# Altium project Rev4.1.PrjPcb
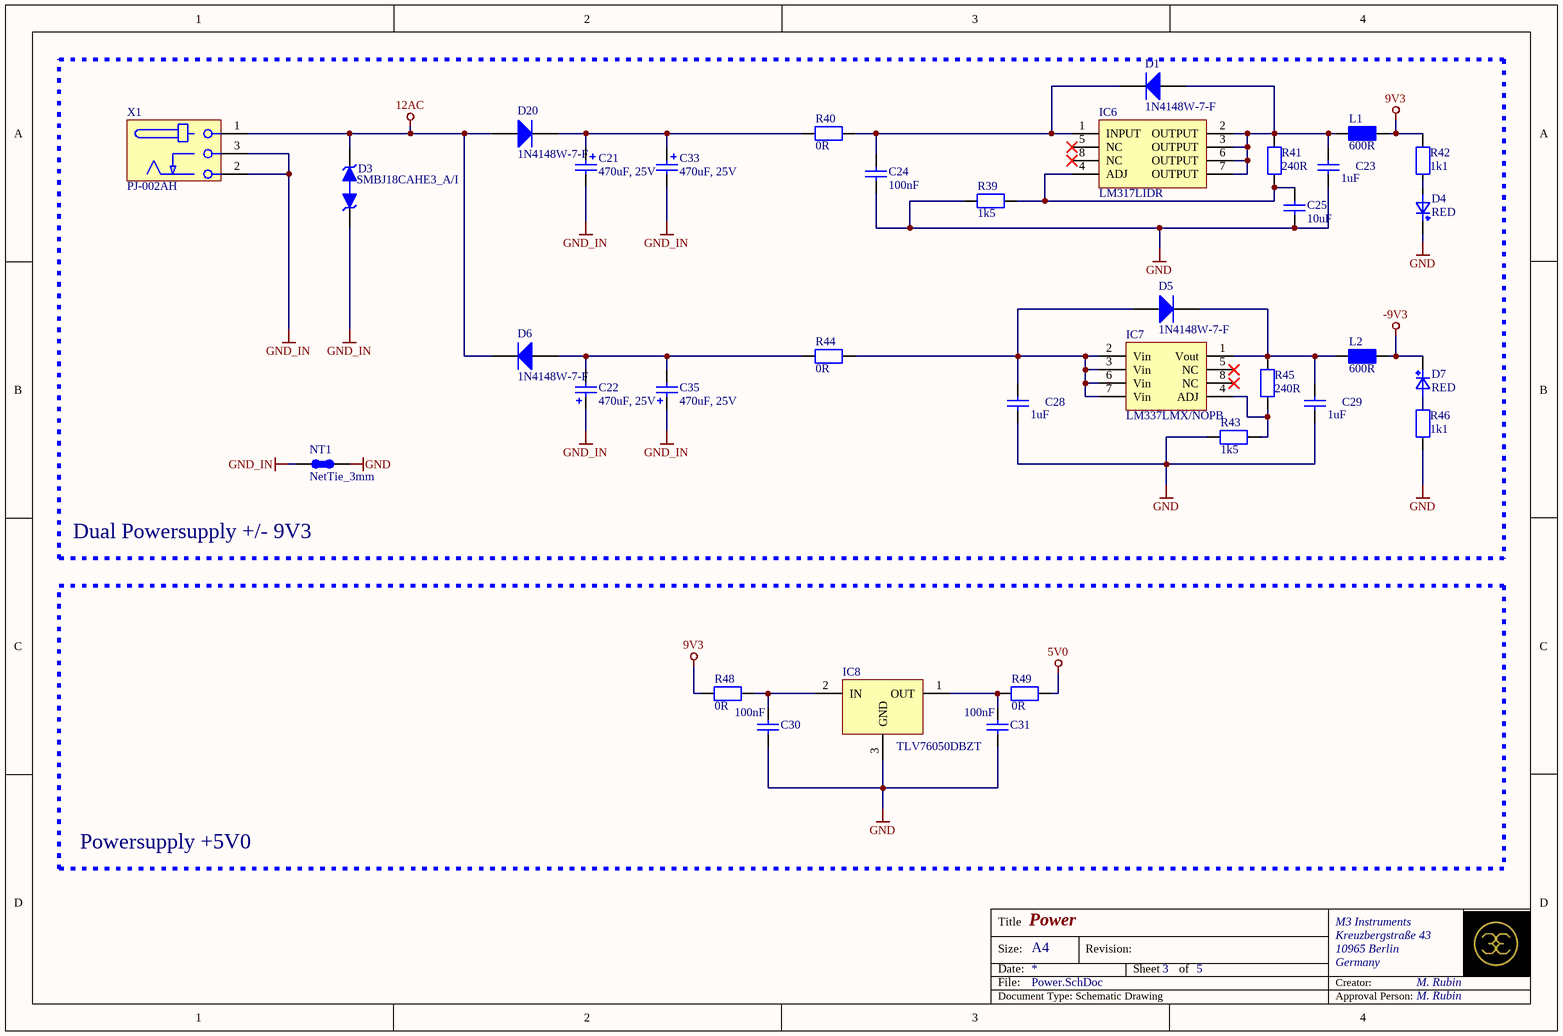
[diagram p0: Power.SchDoc]
Address2: Kreuzbergstraße 43; Address3: 10965 Berlin; Address4: Germany; ApprovalSchematic: M. Rubin; CompanyName: M3 Instruments; CreatorSchematic: M. Rubin
5 sheets, 198 parts. Net scope: flat (ports and power ports of the same name join across sheets).
Board file: mib-pcb0009.PcbDoc
Sheets:
  Power.SchDoc
  LED-Meter.SchDoc
  Filter_R.SchDoc
  Filter_L.SchDoc
  Connector.SchDoc

## Sheet Power.SchDoc: Power
size A4; SheetNumber: 3; SheetTotal: 5

### Parts
C21  470uF, 25V  [WCAP-ATG8_D8H11.5]
C22  470uF, 25V  [WCAP-ATG8_D8H11.5]
C23  1uF  [CAPC2012X145N]
C24  100nF  [CAPC1608X95N]
C25  10uF  [CAPC2012X145N]
C28  1uF  [CAPC2012X145N]
C29  1uF  [CAPC2012X145N]
C30  100nF  [CAPC1608X95N]
C31  100nF  [CAPC1608X95N]
C33  470uF, 25V  [WCAP-ATG8_D8H11.5]
C35  470uF, 25V  [WCAP-ATG8_D8H11.5]
D1  1N4148W-7-F  [SOD-123]
D3  SMBJ18CAHE3_A/I  [DIOM4336X24N]
D4  RED  [WL-SMCW_0805]
D5  1N4148W-7-F  [SOD-123]
D6  1N4148W-7-F  [SOD-123]
D7  RED  [WL-SMCW_0805]
D20  1N4148W-7-F  [SOD-123]
IC6  LM317LIDR  [SOIC127P600X175-8N]
IC7  LM337LMX/NOPB  [SOIC127P600X175-8N]
IC8  TLV76050DBZT  [SOT95P280X135-3N_123]
L1  600R  [INDC2012X85N]
L2  600R  [INDC2012X85N]
NT1  NetTie_3mm  [NET_TIE_3MM]  (net tie, no BOM)
R39  1k5  [RESC2012X70N]
R40  0R  [RESC2012X70N]
R41  240R  [RESC2012X70N]
R42  1k1  [RESC2012X70N]
R43  1k5  [RESC2012X70N]
R44  0R  [RESC2012X70N]
R45  240R  [RESC2012X70N]
R46  1k1  [RESC2012X70N]
R48  0R  [RESC2012X70N]
R49  0R  [RESC2012X70N]
X1  PJ-002AH  [PJ3L1400H110]

### Blocks framed on the sheet
Dual Powersupply +/- 9V3: C21-C25 C28 C29 C33 C35 D1 D3-D7 D20 IC6 IC7 L1 L2 NT1 R39-R46 X1
Powersupply +5V0: C30 C31 IC8 R48 R49

### Nets
5V0: R49.2
9V3: L1.2 R42.2 R48.1
12AC: D3.K D6.2(K) D20.1(A) X1.1
-9V3: D7.K L2.2
GND: C23.1 C24.1 C25.1 C28.1 C29.1 C30.1 C31.1 D4.K IC8.3(GND) NT1.1 R39.1 R43.1 R46.2
GND_IN: C21.N C22.P C33.N C35.P D3.A NT1.2 X1.2 X1.3
NetC21_P: C21.P C33.P D20.2(K) R40.1
NetC22_N: C22.N C35.N D6.1(A) R44.1
NetC23_2: C23.2 D1.1(A) IC6.2(OUTPUT) IC6.3(OUTPUT) IC6.6(OUTPUT) IC6.7(OUTPUT) L1.1 R41.2
NetC24_2: C24.2 D1.2(K) IC6.1(INPUT) R40.2
NetC25_2: C25.2 IC6.4(ADJ) R39.2 R41.1
NetC28_2: C28.2 D5.1(A) IC7.2(Vin) IC7.3(Vin) IC7.6(Vin) IC7.7(Vin) R44.2
NetC29_2: C29.2 D5.2(K) IC7.1(Vout) L2.1 R45.2
NetC30_2: C30.2 IC8.2(IN) R48.2
NetC31_2: C31.2 IC8.1(OUT) R49.1
NetD4_A: D4.A R42.1
NetD7_A: D7.A R46.1
NetIC7_4: IC7.4(ADJ) R43.2 R45.1

Not connected (* = marked no-connect by the designer): IC6 5(NC)* 8(NC)*; IC7 5(NC)* 8(NC)*

### Notes on the sheet
- Title
- Size:
- Date:
- File:
- A4
- Revision:
- Sheet
- of
- Creator:
- Document Type: Schematic Drawing
- Approval Person:

### Library data of the parts
C21 C22 C33 C35 = CAP_470uF, 25V: WCAP-ATG8 Aluminum Electrolytic Capacitor, Radial, THT, D8xH11.5, 470uF, 25V; Manufacturer: Wurth Elektronik; Manufacturer Part Number: 860010474013; Voltage Rating: 50V; Tolerance: 20%; Alternatives allowed: YES
C23 C28 C29 = CAP_1uF_0805: Multilayer Ceramic Capacitors MLCC - SMD/SMT, 1uF; Manufacturer: Samsung Electro-Mechanics; Manufacturer Part Number: CL21B105KBFNNNE; Voltage Rating: 50V; Tolerance: 10%; Alternatives allowed: yes; JLC: C28323
C24 C30 C31 = CAP_100nF_0603: Multilayer Ceramic Capacitors MLCC - SMD/SMT, 100nF; Manufacturer: YAGEO; Manufacturer Part Number: CC0603KRX7R9BB104; Voltage Rating: 50VDC; Tolerance: 10%; Alternatives allowed: yes; JLC: C14663
C25 = CAP_10uF_0805: Multilayer Ceramic Capacitors MLCC - SMD/SMT, 10uF; Manufacturer: Samsung Electro-Mechanics; Manufacturer Part Number: CL21A106KAYNNNE; Voltage Rating: 25V; Tolerance: 10%; Alternatives allowed: yes; JLC: C15850
D1 D5 D6 D20 = 1N4148W-7-F: Diodes - General Purpose, Power, Switching SURFACE MOUNT FAST SWITCHING DIODE 2A; Manufacturer: Diodes Incorporated; Package: SOD-123; Manufacturer Part Number: 1N4148W-7-F; JLC: C81598
D3 = DIO_SMBJ18CAHE3_A/I: ESD Suppressors / TVS Diodes 600W 18V 5% SMB (DO-214AA); Manufacturer: Vishay General Semiconductor; Alternatives allowed: YES; Manufacturer Part Number: SMBJ18CAHE3_A/I; Voltage Rating: 18V
D4 D7 = LED_0805_RED_AK: Standard LEDs - SMD WL-SMCW SMDMono TpVw Waterclr 0805 Red; Manufacturer: Wurth Elektronik; Manufacturer Part Number: 150080RS75000; Voltage Rating: 2.0; Alternatives allowed: YES; JLC: C84256
IC6 = IC_LM317LIDR: Linear Voltage Regulators; Manufacturer: Texas Instruments; Alternatives allowed: NO; Manufacturer Part Number: LM317LIDR; JLC: *
IC7 = IC_LM337LMX/NOPB: IC REG LIN POS ADJ 300MA SOT25; Manufacturer: Texas Instruments; Alternatives allowed: NO; Manufacturer Part Number: LM337LMX/NOPB; JLC: *
IC8 = IC_TLV76050DBZT: PMIC - Spannungsregler - Linear Positiv Fest 1 Ausgang 100mA SOT-23-3; Manufacturer: Texas Instruments; Alternatives allowed: NO; Manufacturer Part Number: TLV76050DBZT; JLC: *
L1 L2 = FB_600R_600mA_0805: Ferrite Beads 0805 600 OHM; Manufacturer: Murata Electronics; Manufacturer Part Number: BLM21AG601SN1D; Lumira Part Number: MS-1042; Tolerance: 25%; Alternatives allowed: YES; JLC: C1017
NT1 = NetTie_3mm: 3mm NetTie; Notes: PCB connection only
R39 R43 = RES_1k5_0805: Thick Film Resistors - SMD 1.5 kOhms 125 mW 0805 1% AEC-Q200; Manufacturer: YAGEO; Manufacturer Part Number: AC0805FR-071K5L; Voltage Rating: 150V; Alternatives allowed: YES; Tolerance: 1%; JLC: C4310
R40 R44 R48 R49 = RES_0R_0805: Thick Film Resistors - SMD 1/8watt ZEROohm Jumper; Manufacturer: Vishay; Manufacturer Part Number: CRCW08050000Z0EA; Voltage Rating: 150V; Tolerance: 1%; Alternatives allowed: YES; JLC: C17477
R41 R45 = RES_240R_0805: Thick Film Resistors - SMD 1/8watt 240ohms 1%; Manufacturer: Vishay / Dale; Manufacturer Part Number: CRCW0805240RFKEA; Voltage Rating: 150V; Alternatives allowed: YES; Tolerance: 1%; JLC: C17572
R42 R46 = RES_1k1_0805: Thick Film Resistors - SMD 1/8watt 1.1Kohms 1% 100ppm; Manufacturer: Vishay / Dale; Manufacturer Part Number: CRCW08051K10FKEA; Voltage Rating: 150V; Alternatives allowed: YES; Tolerance: 1%
X1 = PJ-002AH: DC Power Connectors Power Jacks, Inside Contact Diameter 2mm, Outside Contact Diameter 6,5mm; Manufacturer: CUI Devices; Lumira Part Number: S-QMS-SPEC-32532; Voltage Rating: 24V; Alternatives allowed: NO; Manufacturer Part Number: PJ-002AH

## Sheet LED-Meter.SchDoc: LED-Meter
size A3; CompanyName: M3 Instruments GmbH; SheetNumber: 5; SheetTotal: 5
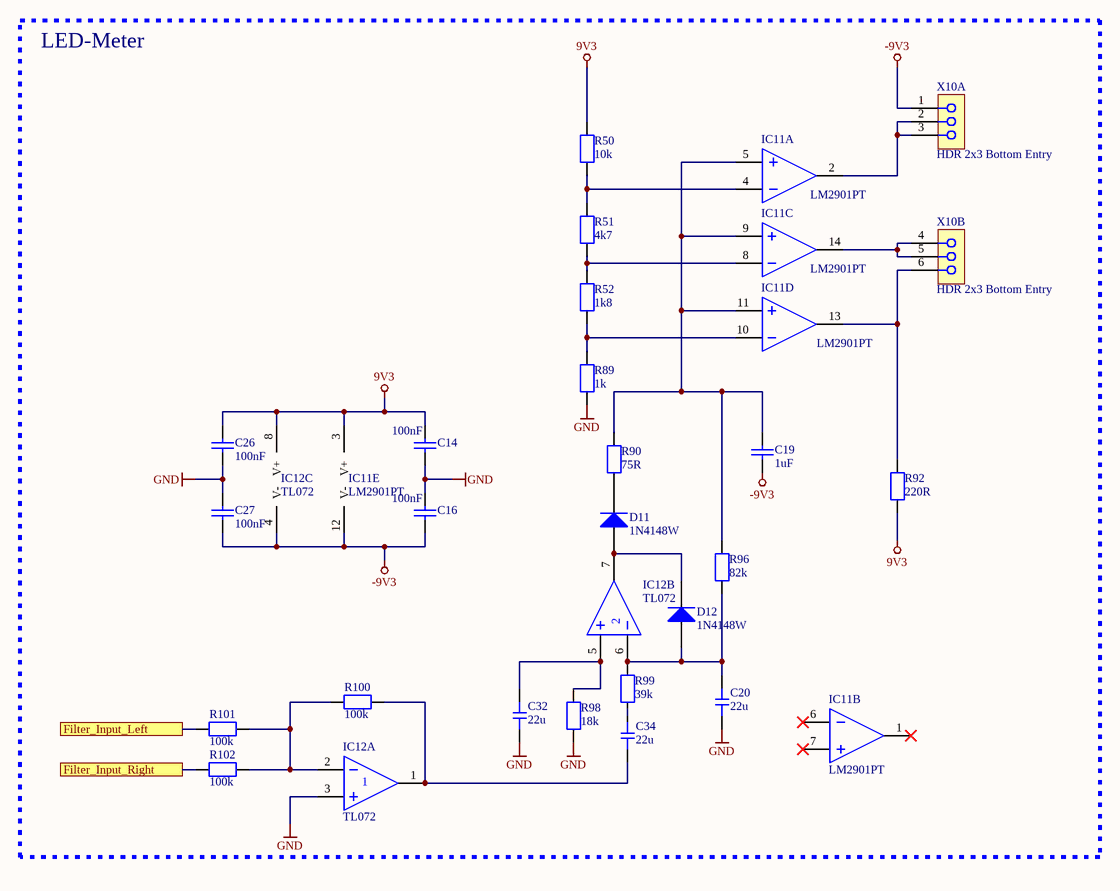
[diagram p1: LED-Meter.SchDoc]

### Parts
C14  100nF  [CAPC1608X95N]
C16  100nF  [CAPC1608X95N]
C19  1uF  [CAPC2012X145N]
C20  22u  [CAPC2012X145N]
C26  100nF  [CAPC1608X95N]
C27  100nF  [CAPC1608X95N]
C32  22u  [CAPC2012X145N]
C34  22u  [CAPC2012X145N]
D11  1N4148W  [SOD-123]
D12  1N4148W  [SOD-123]
IC11  LM2901PT  [TSOP65P640X105-14N]  (parts A,B,C,D,E of 5)
IC12  TL072  [SOIC127P600X175-8N]  (parts A,B,C of 3)
R50  10k  [RESC2012X70N]
R51  4k7  [RESC2012X70N]
R52  1k8  [RESC2012X70N]
R89  1k  [RESC2012X70N]
R90  75R  [RESC2012X70N]
R92  220R  [RESC2012X70N]
R96  82k  [RESC2012X70N]
R98  18k  [RESC2012X70N]
R99  39k  [RESC2012X70N]
R100  100k  [RESC2012X70N]
R101  100k  [RESC2012X70N]
R102  100k  [RESC2012X70N]
X10  HDR 2x3 Bottom Entry  [613006216921-poti]  (parts A,B of 2)

### Blocks framed on the sheet
LED-Meter: C14 C16 C19 C20 C26 C27 C32 C34 D11 D12 IC11 IC12 R50-R52 R89 R90 R92 R96 R98-R102 X10

### Ports
Filter_Input_Left, Filter_Input_Right

### Nets
9V3: C14.2 C26.1 IC11.3(V+) IC12.8(V+) R50.2 R92.1
-9V3: C16.1 C19.1 C27.2 IC11.12(V-) IC12.4(V-) X10.1
GND: C14.1 C16.2 C20.1 C26.2 C27.1 C32.1 IC12.3(IN+) R89.1 R98.1
Filter_Input_Left: R101.1 ; port Filter_Input_Left
Filter_Input_Right: R102.1 ; port Filter_Input_Right
NetC19_2: C19.2 IC11.5(IN1+) IC11.9(IN3+) IC11.11(IN4+) R90.2 R96.2
NetC20_2: C20.2 D12.1(A) IC12.6(IN-) R96.1 R99.2
NetC32_2: C32.2 IC12.5(IN+) R98.2
NetC34_1: C34.1 IC12.1(OUT) R100.2
NetC34_2: C34.2 R99.1
NetD11_1: D11.1(A) D12.2(K) IC12.7(OUT)
NetD11_2: D11.2(K) R90.1
NetIC11_2: IC11.2(OUT_1) X10.2 X10.3
NetIC11_4: IC11.4(IN1-) R50.1 R51.2
NetIC11_8: IC11.8(IN3-) R51.1 R52.2
NetIC11_10: IC11.10(IN4-) R52.1 R89.2
NetIC11_13: IC11.13(OUT_4) R92.2 X10.6
NetIC11_14: IC11.14(OUT_3) X10.4 X10.5
NetIC12_2: IC12.2(IN-) R100.1 R101.2 R102.2

Not connected (* = marked no-connect by the designer): IC11 1(OUT_2)* 6(IN2-)* 7(IN2+)*

### Notes on the sheet
- Title
- Size:
- Date:
- File:
- A3
- Revision:
- Sheet
- of
- Creator:
- Document Type: Schematic Drawing
- Approval Person:

### Library data of the parts
C14 C16 C26 C27 = CAP_100nF_0603: as C24 on sheet Power; JLC: C14663
C19 = CAP_1uF_0805: as C23 on sheet Power; JLC: C28323
C20 C32 C34 = CAP_22u_35V_0805: SMD, 22 µF, 35 V, 0805 [metric 2012], ± 20%, X5R, C Series TDK; Manufacturer Part Number: C2012X5R1V226M125AC; Voltage Rating: 35V; Tolerance: +-20%; Alternatives allowed: YES; Notes: X5R, 0805; Value: 22uF; Manufacturer: TDK; JLC: C45783
D11 D12 = 1N4148W: 75V 150mA 1.25V @ 150mA 4ns SOD-123 Switching Diode RoHS; Manufacturer: ST(Semtech); Package: SOD-123; Supplier: LC; SuppliersPartNumber: C81598; Manufacturer Part Number: 1N4148W
IC11 = IC_LM2901PT: Analog Comparators Lo-Pwr Quad Voltage; Manufacturer: STMicroelectronics; Alternatives allowed: NO; Manufacturer Part Number: LM2901PT
IC12 = IC_TL072: Operational Amplifiers - Op Amps Dual JFET Op Amp; Manufacturer: Texas Instruments; Manufacturer Part Number: TL072CDR; Alternatives allowed: NO; JLC: C6961
R50 = RES_10k_0805: Thick Film Resistors - SMD 1/8watt 10Kohms 1% 100ppm; Manufacturer: Vishay / Dale; Manufacturer Part Number: CRCW080510K0FKEA; Voltage Rating: 150V; Alternatives allowed: YES; Tolerance: 1%; JLC: C17414
R51 = RES_4k7_0805: Thick Film Resistors - SMD 1/8Watt 4.7Kohms 1% Commercial Use; Manufacturer: Vishay / Dale; Manufacturer Part Number: CRCW08054K70FKEAC; Voltage Rating: 150V; Alternatives allowed: YES; Tolerance: 1%; JLC: C17673
R52 = RES_1k8_0805: Thick Film Resistors - SMD 1/8Watt 1.8Kohms 1% Commercial Use; Manufacturer: Vishay / Dale; Manufacturer Part Number: CRCW08051K80FKEAC; Voltage Rating: 150V; Alternatives allowed: YES; Tolerance: 1%; JLC: C17398
R89 = RES_1k_0805: Thick Film Resistors - SMD 1/8watt 1Kohms 1% 100ppm; Manufacturer: Vishay / Dale; Manufacturer Part Number: CRCW08051K00FKEA; Voltage Rating: 150V; Alternatives allowed: YES; Tolerance: 1%; JLC: C17513
R90 = RES_75R_0805: Thick Film Resistors - SMD 75 Ohms 125 mW 0805 1%; Manufacturer: YAGEO; Manufacturer Part Number: RC0805FR-0775RL; Voltage Rating: 150V; Alternatives allowed: YES; Tolerance: 1%
R92 = RES_220R_0805: Thick Film Resistors - SMD 1/8watt 220ohms 1% 100ppm; Manufacturer: Vishay / Dale; Manufacturer Part Number: CRCW0805220RFKEA; Voltage Rating: 150V; Alternatives allowed: YES; Tolerance: 1%; JLC: C17557
R96 = RES_82k_0805: Thick Film Resistors - SMD 82 kOhms 125 mW 0805 1%; Manufacturer: YAGEO; Manufacturer Part Number: RC0805FR-0782KL; Voltage Rating: 150V; Alternatives allowed: YES; Tolerance: 1%; JLC: C17840
R98 = RES_18k_0805: Thick Film Resistors - SMD 18kOhms 1/8W 0805 1%; Manufacturer: YAGEO; Manufacturer Part Number: RC0805FR-1018KL; Voltage Rating: 150V; Alternatives allowed: YES; Tolerance: 1%; JLC: C17506
R99 = RES_39k_0805: Thick Film Resistors - SMD 39 kOhms 125 mW 0805 1%; Manufacturer: YAGEO; Manufacturer Part Number: RC0805FR-0739KL; Voltage Rating: 150V; Alternatives allowed: YES; Tolerance: 1%; JLC: C25826
R100-R102 = RES_100k_0805: Thick Film Resistors - SMD 1/8watt 100Kohms 1% 100ppm; Manufacturer: Vishay / Dale; Manufacturer Part Number: CRCW0805100KFKEA; Voltage Rating: 150V; Alternatives allowed: YES; Tolerance: 1%; JLC: C17407
X10 = CON_SOCKET_2x3_Poti: Printbuchse, Einführung unten, Board-to-Board, 2.54 mm, 2 Reihe(n), 4 Kontakt(e), Durchsteckmontage; Manufacturer: WE; Manufacturer Part Number: 613004216921; Alternatives allowed: YES

## Sheet Filter_R.SchDoc: Filter_R
size A3; SheetNumber: 1; SheetTotal: 5
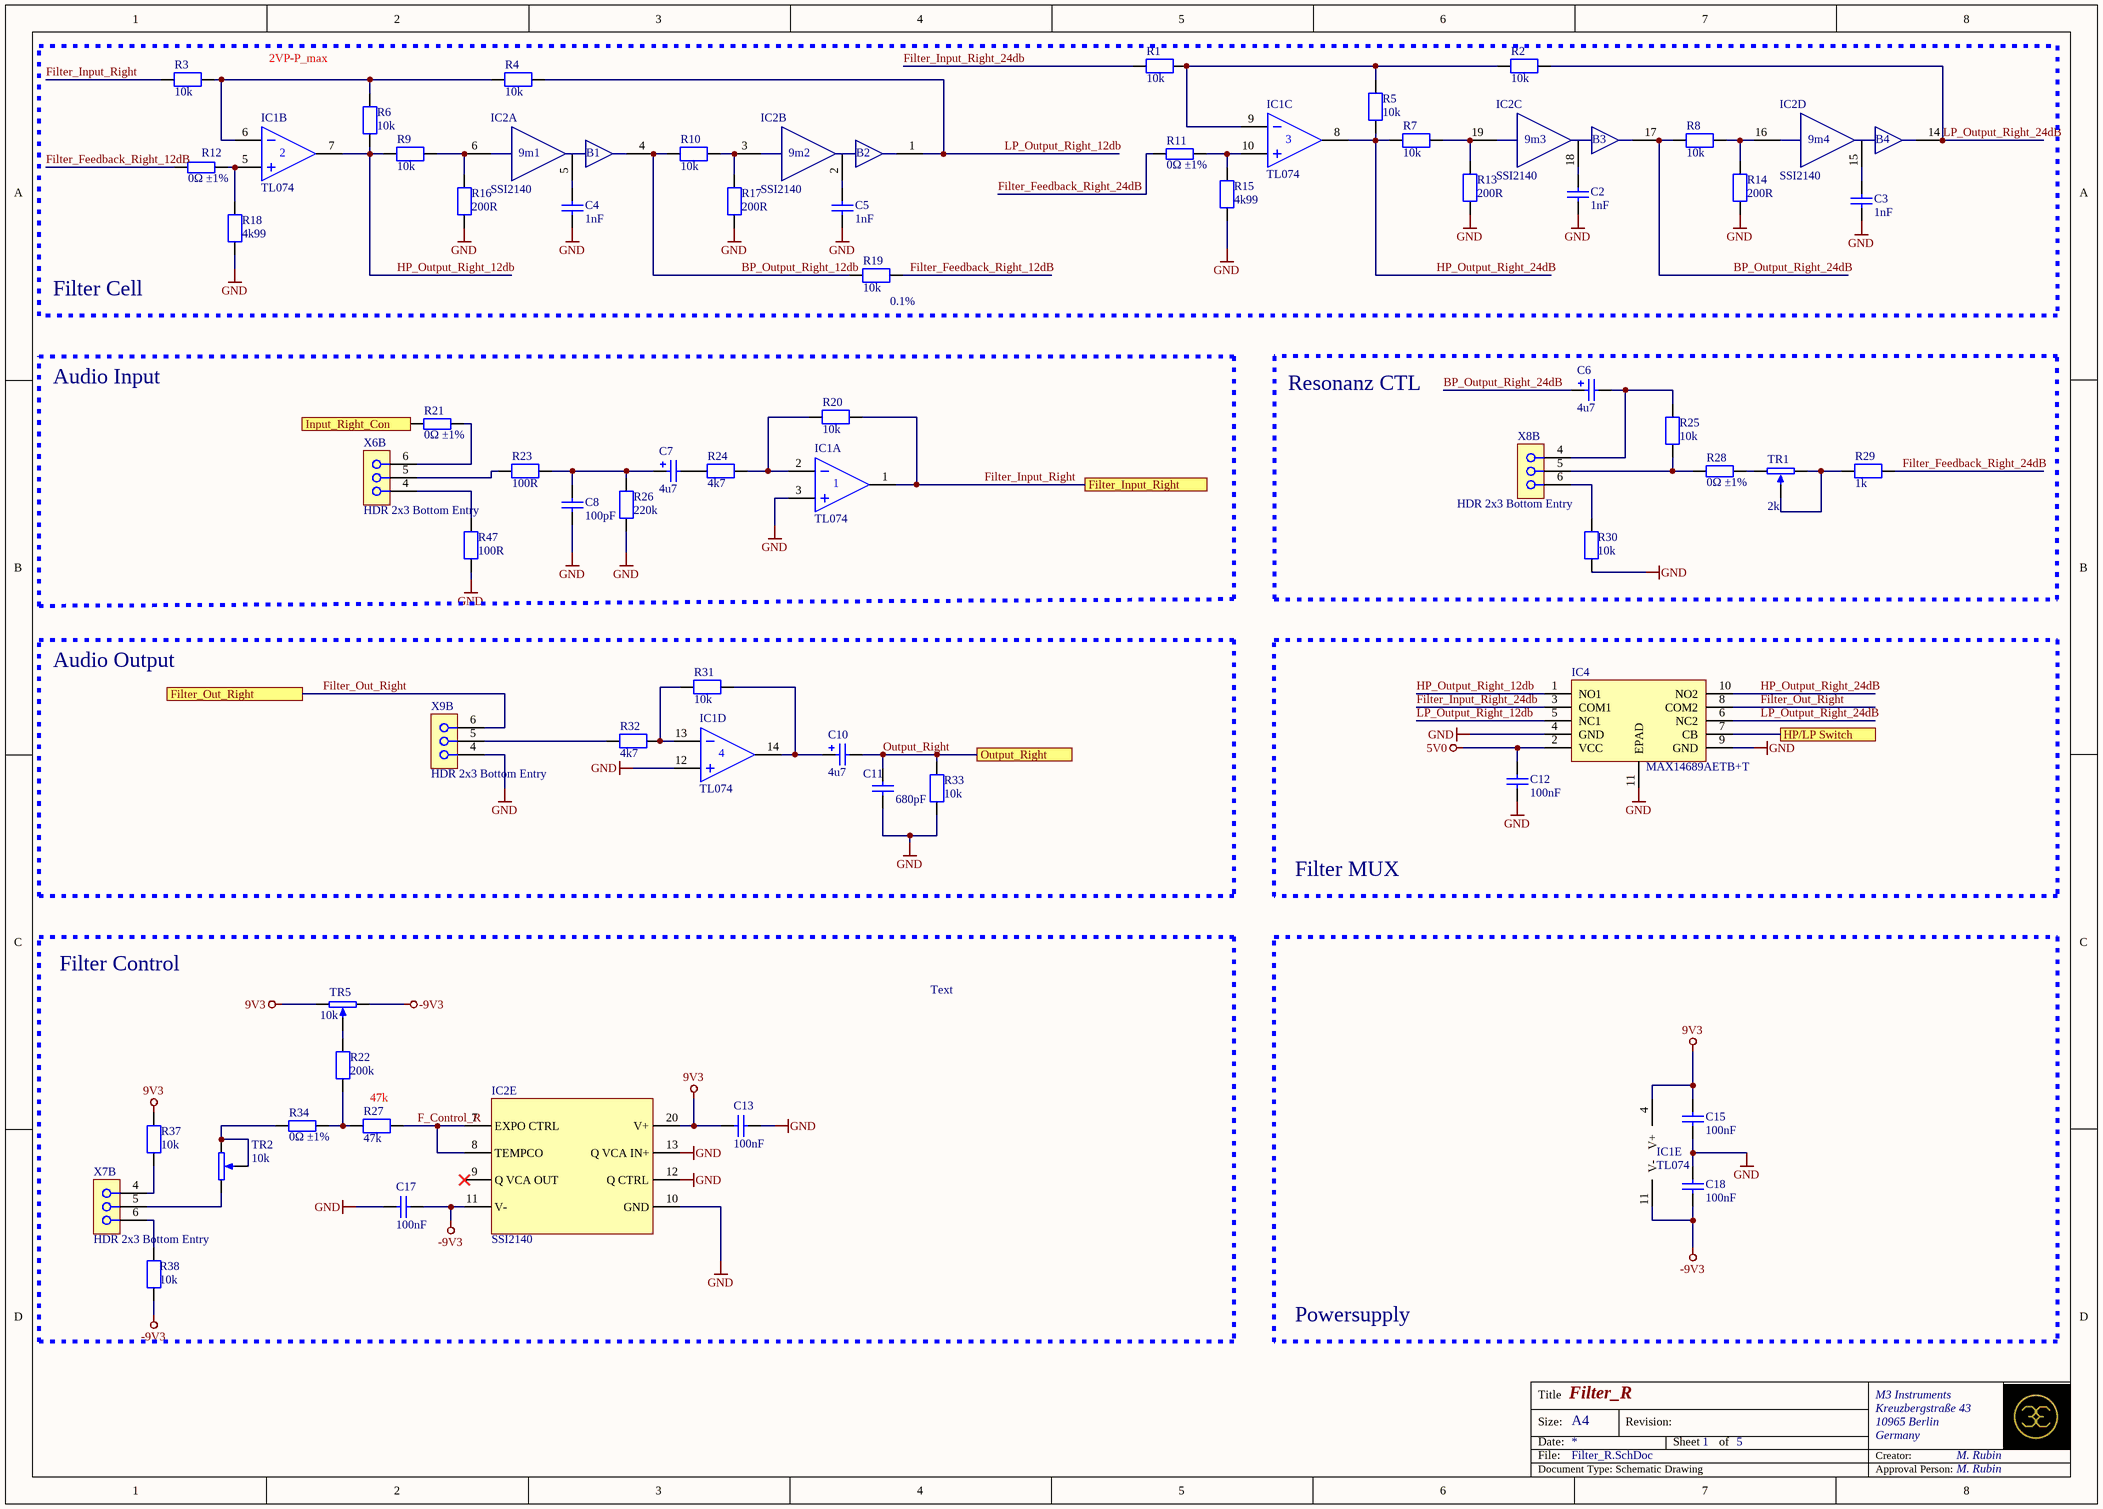
[diagram p2: Filter_R.SchDoc]

### Parts
C2  1nF  [CAPC2012X145N]  (no BOM)
C3  1nF  [CAPC2012X145N]  (no BOM)
C4  1nF  [CAPC2012X145N]  (no BOM)
C5  1nF  [CAPC2012X145N]  (no BOM)
C6  4u7  [CAPAE4643X54M]
C7  4u7  [CAPAE4643X54M]
C8  100pF  [CAPC2012X145N]
C10  4u7  [CAPAE4643X54M]
C11  680pF  [CAPC2012X145N]
C12  100nF  [CAPC1608X95N]
C13  100nF  [CAPC1608X95N]
C15  100nF  [CAPC1608X95N]
C17  100nF  [CAPC1608X95N]
C18  100nF  [CAPC1608X95N]
IC1  TL074  [SOIC127P600X175-14N]  (parts A,B,C,D,E of 5)
IC2  SSI2140  [SOP65P650-20N]  (parts A,B,C,D,E of 5)
IC4  MAX14689AETB+T  [QFN40P200X250X80_HS-11N]
R1  10k  [RESC2012X70N]
R2  10k  [RESC2012X70N]
R3  10k  [RESC2012X70N]
R4  10k  [RESC2012X70N]
R5  10k  [RESC2012X70N]
R6  10k  [RESC2012X70N]
R7  10k  [RESC2012X70N]
R8  10k  [RESC2012X70N]
R9  10k  [RESC2012X70N]
R10  10k  [RESC2012X70N]
R11  0Ω ±1%  [RESC2012X70N]
R12  0Ω ±1%  [RESC2012X70N]
R13  200R  [RESC2012X70N]
R14  200R  [RESC2012X70N]
R15  4k99  [RESC2012X70N]
R16  200R  [RESC2012X70N]
R17  200R  [RESC2012X70N]
R18  4k99  [RESC2012X70N]
R19  10k  [RESC2012X70N]
R20  10k  [RESC2012X70N]
R21  0Ω ±1%  [RESC2012X70N]
R22  200k  [RESC2012X70N]
R23  100R  [RESC2012X70N]
R24  4k7  [RESC2012X70N]
R25  10k  [RESC2012X70N]
R26  220k  [RESC2012X70N]
R27  47k  [RESC2012X70N]
R28  0Ω ±1%  [RESC2012X70N]
R29  1k  [RESC2012X70N]
R30  10k  [RESC2012X70N]
R31  10k  [RESC2012X70N]
R32  4k7  [RESC2012X70N]
R33  10k  [RESC2012X70N]
R34  0Ω ±1%  [RESC2012X70N]
R37  10k  [RESC2012X70N]
R38  10k  [RESC2012X70N]
R47  100R  [RESC2012X70N]
TR1  2k  [PVG3G503C01R00]
TR2  10k  [3296Y]
TR5  10k  [3296Y]
X6  HDR 2x3 Bottom Entry  [613006216921-poti]  (part B of 2)
X7  HDR 2x3 Bottom Entry  [613006216921-poti]  (part B of 2)
X8  HDR 2x3 Bottom Entry  [613006216921-poti]  (part B of 2)
X9  HDR 2x3 Bottom Entry  [613006216921-poti]  (part B of 2)

### Blocks framed on the sheet
Filter Cell: C2-C5 IC1 IC2 R1-R19
Audio Input: C7 C8 IC1 R20 R21 R23 R24 R26 R47 X6
Resonanz CTL: C6 R25 R28-R30 TR1 X8
Audio Output: C10 C11 IC1 R31-R33 X9
Filter MUX: C12 IC4
Filter Control: C13 C17 IC2 R22 R27 R34 R37 R38 TR2 TR5 X7
Powersupply: C15 C18 IC1

### Ports
Filter_Input_Right, Filter_Out_Right, HP/LP Switch, Input_Right_Con, Output_Right

### Nets
5V0: C12.2 IC4.2(VCC)
9V3: C13.1 C15.2 IC1.4(V+) IC2.20(V+) R37.2 TR5.1
-9V3: C17.2 C18.1 IC1.11(V-) IC2.11(V-) R38.1 TR5.3
GND: C2.1 C3.1 C4.1 C5.1 C8.1 C11.1 C12.1 C13.2 C15.1 C17.1 C18.2 IC1.3(IN+) IC1.12(IN+) IC2.10(GND) IC2.12(Q_CTRL) IC2.13(Q_VCA_IN+) IC4.4(GND) IC4.9(GND) IC4.11(EPAD) R13.1 R14.1 R15.1 R16.1 R17.1 R18.1 R26.1 R30.1 R33.1 R47.1 X9.4
BP_Output_Right_12db: IC2.4(OUT_1) R10.1 R19.1
BP_Output_Right_24dB: C6.1 IC2.17(OUT_3) R8.1
F_Control_R: IC2.7(EXPO_CTRL) IC2.8(TEMPCO) R27.2
Filter_Feedback_Right_12dB: R12.1 R19.2
Filter_Feedback_Right_24dB: R11.1 R29.1
Filter_Input_Right: IC1.1(OUT) R3.1 R20.1 ; port Filter_Input_Right
Filter_Input_Right_24db: IC4.3(COM1) R1.2
Filter_Out_Right: IC4.8(COM2) X9.6 ; port Filter_Out_Right
HP_Output_Right_12db: IC1.7(OUT) IC4.1(NO1) R6.1 R9.1
HP_Output_Right_24dB: IC1.8(OUT) IC4.10(NO2) R5.1 R7.1
Input_Right_Con: R21.1 ; port Input_Right_Con
LP_Output_Right_12db: IC2.1(OUT_2) IC4.5(NC1) R4.2
LP_Output_Right_24dB: IC2.14(OUT_4) IC4.6(NC2) R2.2
Output_Right: C10.2 C11.2 R33.2 ; port Output_Right
NetC2_2: C2.2 IC2.18(CAP_3)
NetC3_2: C3.2 IC2.15(CAP_4)
NetC4_2: C4.2 IC2.5(CAP_1)
NetC5_2: C5.2 IC2.2(CAP_2)
NetC6_2: C6.2 R25.2 X8.4
NetC7_1: C7.1 C8.2 R23.2 R26.2
NetC7_2: C7.2 R24.2
NetC10_1: C10.1 IC1.14(OUT) R31.1
NetIC1_2: IC1.2(IN-) R20.2 R24.1
NetIC1_5: IC1.5(IN+) R12.2 R18.2
NetIC1_6: IC1.6(IN-) R3.2 R4.1 R6.2
NetIC1_9: IC1.9(IN+) R1.1 R2.1 R5.2
NetIC1_10: IC1.10(IN-) R11.2 R15.2
NetIC1_13: IC1.13(IN-) R31.2 R32.1
NetIC2_3: IC2.3(IN_2) R10.2 R17.2
NetIC2_6: IC2.6(IN_1) R9.2 R16.2
NetIC2_16: IC2.16(IN_4) R8.2 R14.2
NetIC2_19: IC2.19(IN_3) R7.2 R13.2
NetIC4_7: IC4.7(CB) ; port HP/LP Switch
NetR21_2: R21.2 X6.6
NetR22_1: R22.1 R27.1 R34.2
NetR22_2: R22.2 TR5.2
NetR23_1: R23.1 X6.5
NetR25_1: R25.1 R28.1 X8.5
NetR28_2: R28.2 TR1.1
NetR29_2: R29.2 TR1.2 TR1.3
NetR30_2: R30.2 X8.6
NetR32_2: R32.2 X9.5
NetR34_1: R34.1 TR2.2 TR2.3
NetR37_1: R37.1 X7.4
NetR38_2: R38.2 X7.6
NetR47_2: R47.2 X6.4
NetTR2_1: TR2.1 X7.5

Not connected (* = marked no-connect by the designer): IC2 9(Q_VCA_OUT)*

### Notes on the sheet
- 2VP-P_max
- (near R19) 0.1%
- Text
- 47k
- Title
- Size:
- Date:
- File:
- A4
- Revision:
- Sheet
- of
- Creator:
- Document Type: Schematic Drawing
- Approval Person:
- (in symbol IC_SSI2140, part A) 9m1; B1
- (in symbol IC_SSI2140, part B) 9m2; B2
- (in symbol IC_SSI2140, part C) 9m3; B3
- (in symbol IC_SSI2140, part D) 9m4; B4

### Library data of the parts
C2 C4 = CAP_1nF_630V: Multilayer Ceramic Capacitors MLCC - SMD/SMT, C0G(NP0), 100nF; Manufacturer: Murata Electronics; Manufacturer Part Number: GRM21B5C2J102JWA3L; Voltage Rating: 630VDC; Tolerance: 5%; Alternatives allowed: yes
C3 C5 = CAP_100nF_630V: Multilayer Ceramic Capacitors MLCC - SMD/SMT, C0G(NP0), 1nF; Manufacturer: Murata Electronics; Manufacturer Part Number: GRM21B5C2J102JWA3L; Voltage Rating: 630VDC; Tolerance: 5%; Alternatives allowed: yes
C6 C7 C10 = CAP_4u7: Aluminium Electrolytic Capacitors - SMD 4.7UF 16V ELECT VS BI-POLAR; Manufacturer: Panasonic; Manufacturer Part Number: EEE-1CA4R7NR; Tolerance: 20%; Alternatives allowed: NO; Voltage Rating: 16V
C8 = CAP_100pF_0805: Film Capacitors 100pF 50VDC 2% PPS FILM 0805; Manufacturer: Panasonic; Manufacturer Part Number: ECH-U1H101GX5; Voltage Rating: 50V; Alternatives allowed: NO; Tolerance: 2%
C11 = CAP_680pF_0805: Film Capacitors 680pF 50VDC 2% PPS FILM 0805; Manufacturer: Panasonic; Manufacturer Part Number: ECH-U1H681GX5; Voltage Rating: 50V; Alternatives allowed: NO; Tolerance: 2%
C12 C13 C15 C17 C18 = CAP_100nF_0603: as C24 on sheet Power; JLC: C14663
IC1 = IC_TL074: Operational Amplifiers - Op Amps Dual JFET Op Amp; Manufacturer: Texas Instruments; Manufacturer Part Number: TL074CDR; Alternatives allowed: NO
IC2 = IC_SSI2140: Voltage Controlled Multi-Mode Filter; Manufacturer: Sound Semiconductor; Alternatives allowed: NO; Manufacturer Part Number: SSI2140; JLC: *
IC4 = IC_MAX14689AETB+T: Analogue Switch ICs Ultra-Small, Low-RON, Beyond-the-Rails™, DPDT Analog Switches; Manufacturer: Maxim Integrated; Alternatives allowed: NO; Manufacturer Part Number: MAX14689AETB+T
R1-R10 R19 R20 R25 R31 R33 R37 = RES_10k_0805: as R50 on sheet LED-Meter; Tolerance: 1%; JLC: C17414
R11 R12 R21 R28 R34 = 0805 0R (0R0) 1%: Chip resistor; Manufacturer Part Number: CRCW08050000Z0EAC; Manufacturer: Vishay / Dale; Alternatives allowed: YES; Tolerance: 1%; JLC: C17477
R13 R14 R16 R17 = RES_200R_0805: Thick Film Resistors - SMD 1/8watt 200ohms 1% 100ppm; Manufacturer: Vishay / Dale; Manufacturer Part Number: CRCW0805200RFKEA; Voltage Rating: 150V; Alternatives allowed: YES; Tolerance: 1%; JLC: C17540
R15 R18 = RES_4k99_0805: Thick Film Resistors - SMD 1/8watt 4.99Kohms 1% 100ppm; Manufacturer: Vishay / Dale; Manufacturer Part Number: CRCW08054K99FKEA; Voltage Rating: 150V; Alternatives allowed: YES; Tolerance: 1%; JLC: C17677
R22 = RES_200k_0805: Thick Film Resistors - SMD 1/8watt 200Kohms 1%; Manufacturer: Vishay / Dale; Manufacturer Part Number: CRCW0805200KFKEA; Voltage Rating: 150V; Alternatives allowed: YES; Tolerance: 1%; JLC: C17539
R23 R47 = RES_100R_0805: Thick Film Resistors 1/8watt 100ohms 1% 100ppm; Manufacturer: Vishay / Dale; Manufacturer Part Number: CRCW0805100RFKEA; Voltage Rating: 150V; Alternatives allowed: YES; Tolerance: 1%; JLC: C17408
R24 R32 = RES_4k7_0805: as R51 on sheet LED-Meter; Tolerance: 1%; JLC: C17673
R26 = RES_220k_0805: Thick Film Resistors - SMD 1/8watt 220Kohms 1%; Manufacturer: Vishay / Dale; Manufacturer Part Number: CRCW0805220KFKEA; Voltage Rating: 150V; Alternatives allowed: YES; Tolerance: 1%; JLC: C17556
R27 = RES_47k_0805: Thick Film Resistors - SMD 1/8watt 47Kohms 1%; Manufacturer: Vishay / Dale; Manufacturer Part Number: CRCW080547K0FKEB; Voltage Rating: 150V; Alternatives allowed: YES; Tolerance: 1%; JLC: C17713
R29 = RES_1k_0805: as R89 on sheet LED-Meter; Tolerance: 1%; JLC: C17513
R30 R38 = RES_10k_0805: Thick Film Resistors - SMD 1/8watt 10Kohms 1% 100ppm; Manufacturer Part Number: CRCW080510K0FKEA; Manufacturer: Vishay / Dale; Alternatives allowed: YES; Voltage Rating: 150V; Tolerance: 1%; JLC: C17414
TR1 = TRIM_2k_lin: Trimmer Resistors - SMD 2.0Kohms Sealed 3mm Sngl turn; Manufacturer: Bourns; Manufacturer Part Number: PVG3A202C01R00; Tolerance: 20%
TR2 TR5 = TRIM_10k_lin_25: 10 kOhms 0.5W, 1/2W PC Pins Through Hole Trimmer Potentiometer Cermet 25.0 Turn Top Adjustment; Manufacturer: Bourns; Manufacturer Part Number: 3296Y-1-103LF; Tolerance: 10%
X6-X9 = CON_SOCKET_2x3_Poti: as X10 on sheet LED-Meter

## Sheet Filter_L.SchDoc: Filter_L
size A3; SheetNumber: 2; SheetTotal: 5
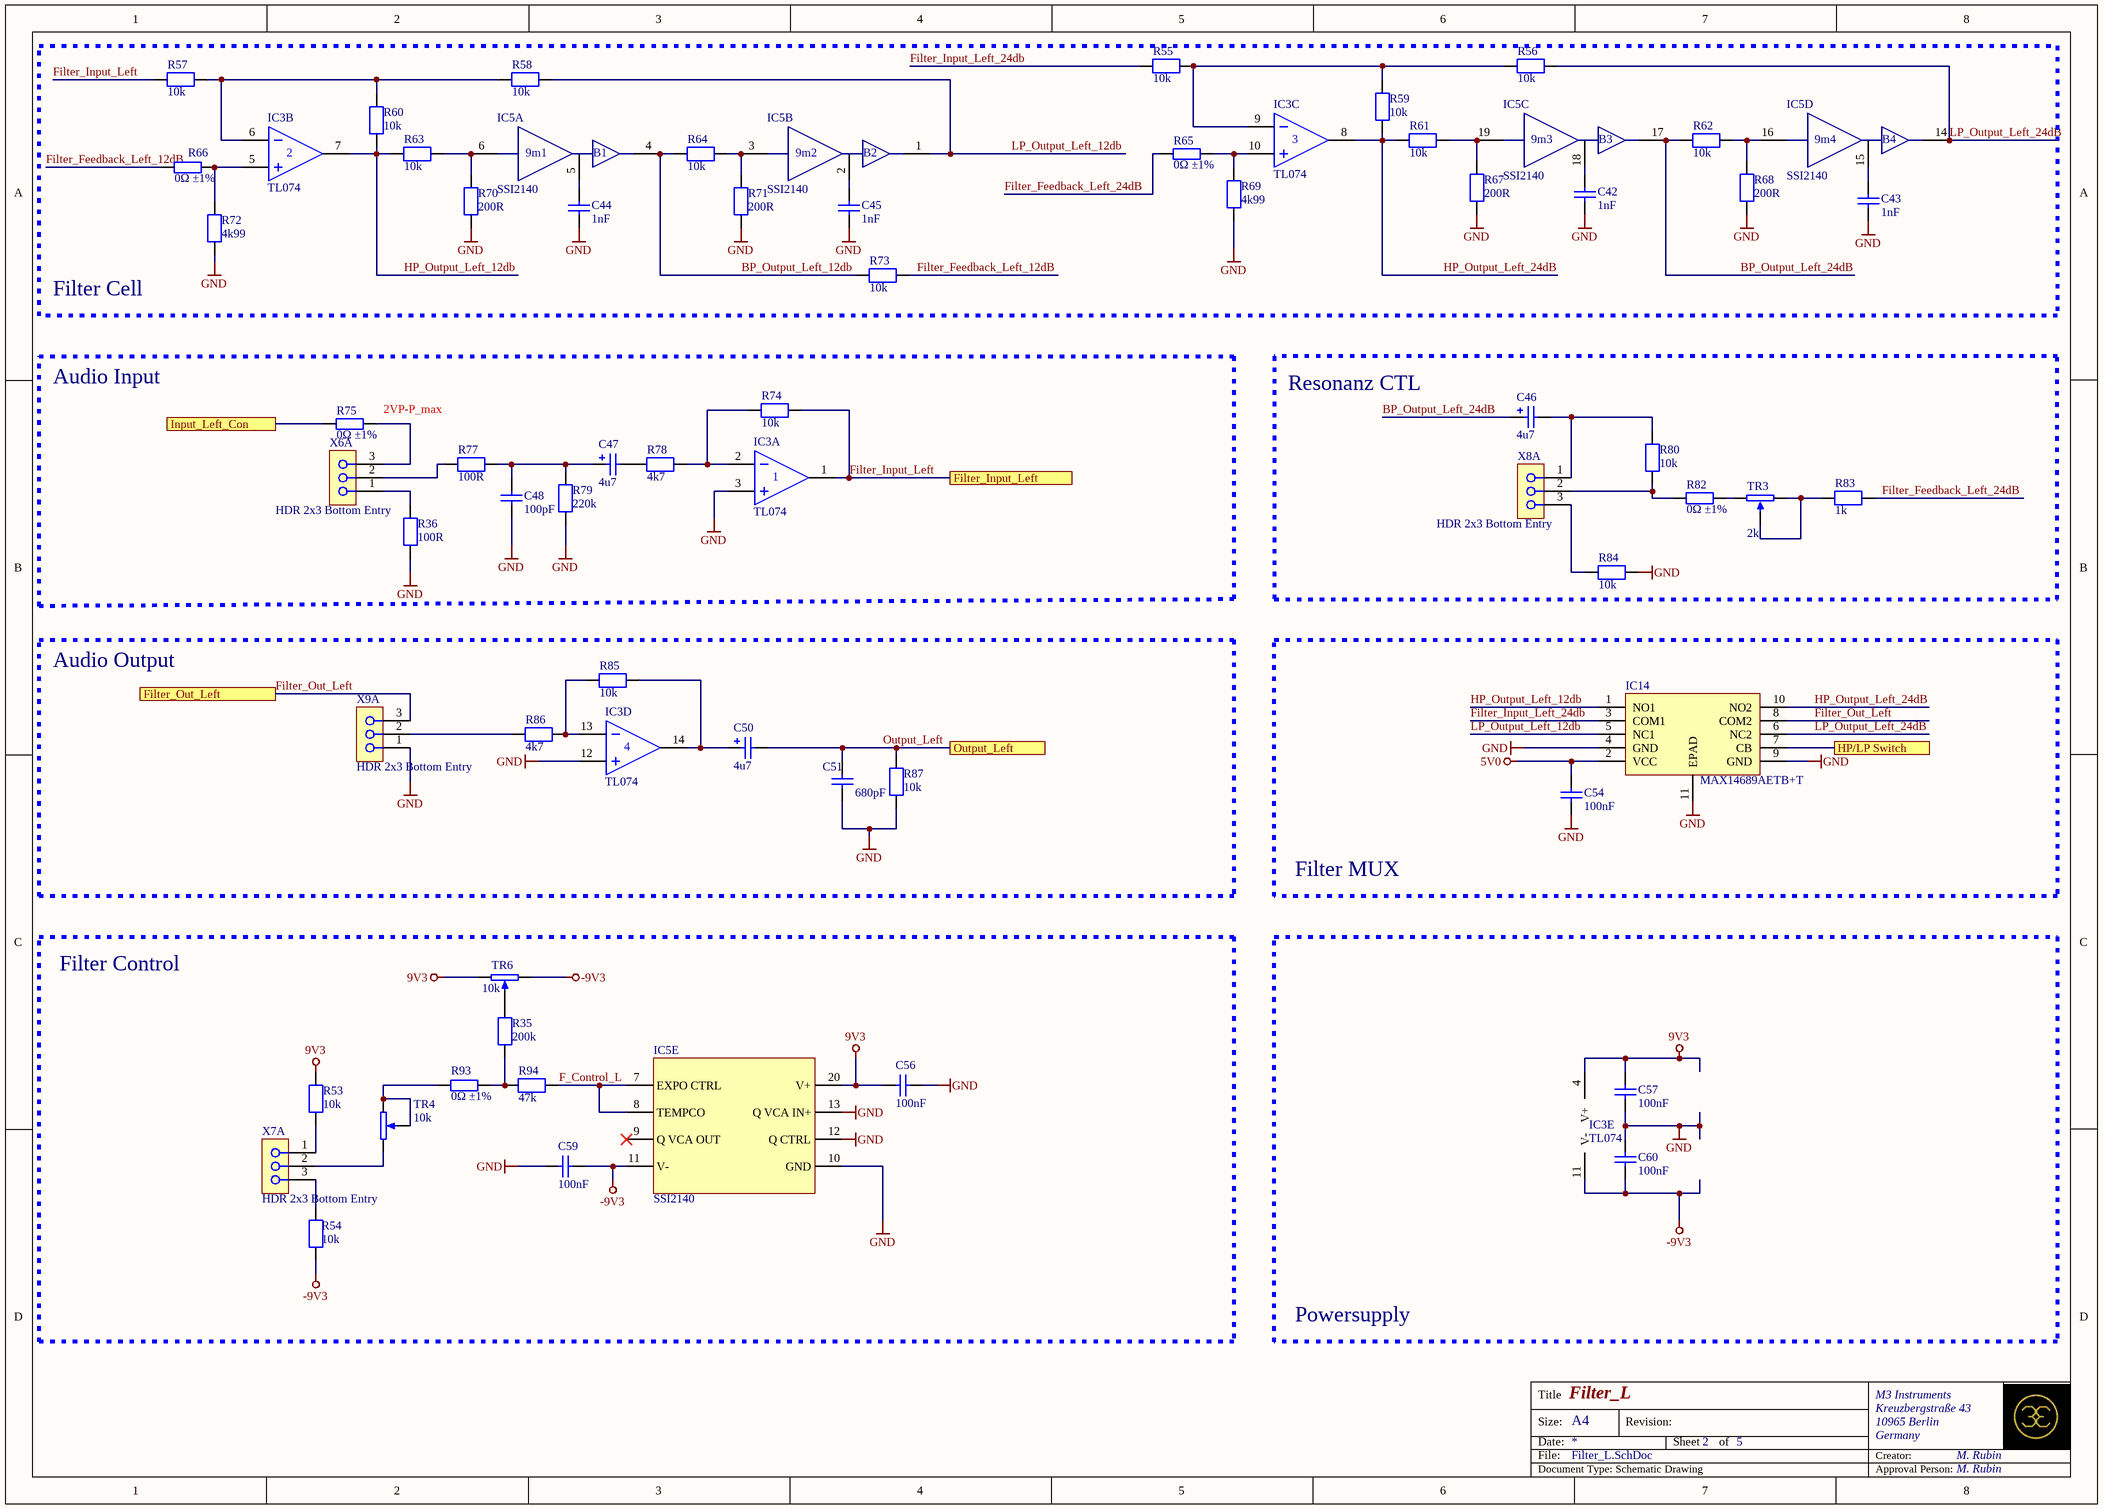
[diagram p3: Filter_L.SchDoc]

### Parts
C42  1nF  [CAPC2012X145N]  (no BOM)
C43  1nF  [CAPC2012X145N]  (no BOM)
C44  1nF  [CAPC2012X145N]  (no BOM)
C45  1nF  [CAPC2012X145N]  (no BOM)
C46  4u7  [CAPAE4643X54M]
C47  4u7  [CAPAE4643X54M]
C48  100pF  [CAPC2012X145N]
C50  4u7  [CAPAE4643X54M]
C51  680pF  [CAPC2012X145N]
C54  100nF  [CAPC1608X95N]
C56  100nF  [CAPC1608X95N]
C57  100nF  [CAPC1608X95N]
C59  100nF  [CAPC1608X95N]
C60  100nF  [CAPC1608X95N]
IC3  TL074  [SOIC127P600X175-14N]  (parts A,B,C,D,E of 5)
IC5  SSI2140  [SOP65P650-20N]  (parts A,B,C,D,E of 5)
IC14  MAX14689AETB+T  [QFN40P200X250X80_HS-11N]
R35  200k  [RESC2012X70N]
R36  100R  [RESC2012X70N]
R53  10k  [RESC2012X70N]
R54  10k  [RESC2012X70N]
R55  10k  [RESC2012X70N]
R56  10k  [RESC2012X70N]
R57  10k  [RESC2012X70N]
R58  10k  [RESC2012X70N]
R59  10k  [RESC2012X70N]
R60  10k  [RESC2012X70N]
R61  10k  [RESC2012X70N]
R62  10k  [RESC2012X70N]
R63  10k  [RESC2012X70N]
R64  10k  [RESC2012X70N]
R65  0Ω ±1%  [RESC2012X70N]
R66  0Ω ±1%  [RESC2012X70N]
R67  200R  [RESC2012X70N]
R68  200R  [RESC2012X70N]
R69  4k99  [RESC2012X70N]
R70  200R  [RESC2012X70N]
R71  200R  [RESC2012X70N]
R72  4k99  [RESC2012X70N]
R73  10k  [RESC2012X70N]
R74  10k  [RESC2012X70N]
R75  0Ω ±1%  [RESC2012X70N]
R77  100R  [RESC2012X70N]
R78  4k7  [RESC2012X70N]
R79  220k  [RESC2012X70N]
R80  10k  [RESC2012X70N]
R82  0Ω ±1%  [RESC2012X70N]
R83  1k  [RESC2012X70N]
R84  10k  [RESC2012X70N]
R85  10k  [RESC2012X70N]
R86  4k7  [RESC2012X70N]
R87  10k  [RESC2012X70N]
R93  0Ω ±1%  [RESC2012X70N]
R94  47k  [RESC2012X70N]
TR3  2k  [PVG3G503C01R00]
TR4  10k  [3296Y]
TR6  10k  [3296Y]
X6  HDR 2x3 Bottom Entry  [613006216921-poti]  (part A of 2)
X7  HDR 2x3 Bottom Entry  [613006216921-poti]  (part A of 2)
X8  HDR 2x3 Bottom Entry  [613006216921-poti]  (part A of 2)
X9  HDR 2x3 Bottom Entry  [613006216921-poti]  (part A of 2)

### Blocks framed on the sheet
Filter Cell: C42-C45 IC3 IC5 R55-R73
Audio Input: C47 C48 IC3 R36 R74 R75 R77-R79 X6
Resonanz CTL: C46 R80 R82-R84 TR3 X8
Audio Output: C50 C51 IC3 R85-R87 X9
Filter MUX: C54 IC14
Filter Control: C56 C59 IC5 R35 R53 R54 R93 R94 TR4 TR6 X7
Powersupply: C57 C60 IC3

### Ports
Filter_Input_Left, Filter_Out_Left, HP/LP Switch, Input_Left_Con, Output_Left

### Nets
5V0: C54.2 IC14.2(VCC)
9V3: C56.1 C57.2 IC3.4(V+) IC5.20(V+) R53.2 TR6.1
-9V3: C59.2 C60.1 IC3.11(V-) IC5.11(V-) R54.1 TR6.3
GND: C42.1 C43.1 C44.1 C45.1 C48.1 C51.1 C54.1 C56.2 C57.1 C59.1 C60.2 IC3.3(IN+) IC3.12(IN+) IC5.10(GND) IC5.12(Q_CTRL) IC5.13(Q_VCA_IN+) IC14.4(GND) IC14.9(GND) IC14.11(EPAD) R36.1 R67.1 R68.1 R69.1 R70.1 R71.1 R72.1 R79.1 R84.2 R87.1 X9.1
BP_Output_Left_12db: IC5.4(OUT_1) R64.1 R73.1
BP_Output_Left_24dB: C46.1 IC5.17(OUT_3) R62.1
F_Control_L: IC5.7(EXPO_CTRL) IC5.8(TEMPCO) R94.2
Filter_Feedback_Left_12dB: R66.1 R73.2
Filter_Feedback_Left_24dB: R65.1 R83.1
Filter_Input_Left: IC3.1(OUT) R57.1 R74.1 ; port Filter_Input_Left
Filter_Input_Left_24db: IC14.3(COM1) R55.2
Filter_Out_Left: IC14.8(COM2) X9.3 ; port Filter_Out_Left
HP_Output_Left_12db: IC3.7(OUT) IC14.1(NO1) R60.1 R63.1
HP_Output_Left_24dB: IC3.8(OUT) IC14.10(NO2) R59.1 R61.1
Input_Left_Con: R75.1 ; port Input_Left_Con
LP_Output_Left_12db: IC5.1(OUT_2) IC14.5(NC1) R58.2
LP_Output_Left_24dB: IC5.14(OUT_4) IC14.6(NC2) R56.2
Output_Left: C50.2 C51.2 R87.2 ; port Output_Left
NetC42_2: C42.2 IC5.18(CAP_3)
NetC43_2: C43.2 IC5.15(CAP_4)
NetC44_2: C44.2 IC5.5(CAP_1)
NetC45_2: C45.2 IC5.2(CAP_2)
NetC46_2: C46.2 R80.2 X8.1
NetC47_1: C47.1 C48.2 R77.2 R79.2
NetC47_2: C47.2 R78.2
NetC50_1: C50.1 IC3.14(OUT) R85.1
NetIC3_2: IC3.2(IN-) R74.2 R78.1
NetIC3_5: IC3.5(IN+) R66.2 R72.2
NetIC3_6: IC3.6(IN-) R57.2 R58.1 R60.2
NetIC3_9: IC3.9(IN+) R55.1 R56.1 R59.2
NetIC3_10: IC3.10(IN-) R65.2 R69.2
NetIC3_13: IC3.13(IN-) R85.2 R86.1
NetIC4_7: IC14.7(CB) ; port HP/LP Switch
NetIC5_3: IC5.3(IN_2) R64.2 R71.2
NetIC5_6: IC5.6(IN_1) R63.2 R70.2
NetIC5_16: IC5.16(IN_4) R62.2 R68.2
NetIC5_19: IC5.19(IN_3) R61.2 R67.2
NetR35_1: R35.1 R93.2 R94.1
NetR35_2: R35.2 TR6.2
NetR36_2: R36.2 X6.1
NetR53_1: R53.1 X7.1
NetR54_2: R54.2 X7.3
NetR75_2: R75.2 X6.3
NetR77_1: R77.1 X6.2
NetR80_1: R80.1 R82.1 X8.2
NetR82_2: R82.2 TR3.1
NetR83_2: R83.2 TR3.2 TR3.3
NetR84_1: R84.1 X8.3
NetR86_2: R86.2 X9.2
NetR93_1: R93.1 TR4.2 TR4.3
NetTR4_1: TR4.1 X7.2

Not connected (* = marked no-connect by the designer): IC5 9(Q_VCA_OUT)*

### Notes on the sheet
- (near R75) 2VP-P_max
- Title
- Size:
- Date:
- File:
- A4
- Revision:
- Sheet
- of
- Creator:
- Document Type: Schematic Drawing
- Approval Person:
- (in symbol IC_SSI2140, part A) 9m1; B1
- (in symbol IC_SSI2140, part B) 9m2; B2
- (in symbol IC_SSI2140, part C) 9m3; B3
- (in symbol IC_SSI2140, part D) 9m4; B4

### Library data of the parts
C42 C44 = CAP_1nF_630V: as C2 on sheet Filter_R
C43 C45 = CAP_100nF_630V: as C3 on sheet Filter_R
C46 C47 C50 = CAP_4u7: as C6 on sheet Filter_R; Voltage Rating: 16V
C48 = CAP_100pF_0805: as C8 on sheet Filter_R; Tolerance: 2%
C51 = CAP_680pF_0805: as C11 on sheet Filter_R; Tolerance: 2%
C54 C56 C57 C59 C60 = CAP_100nF_0603: as C24 on sheet Power; JLC: C14663
IC3 = IC_TL074: as IC1 on sheet Filter_R
IC5 = IC_SSI2140: as IC2 on sheet Filter_R; Manufacturer Part Number: SSI2140; JLC: *
IC14 = IC_MAX14689AETB+T: as IC4 on sheet Filter_R; Manufacturer Part Number: MAX14689AETB+T
R35 = RES_200k_0805: as R22 on sheet Filter_R; Tolerance: 1%; JLC: C17539
R36 R77 = RES_100R_0805: as R23 on sheet Filter_R; Tolerance: 1%; JLC: C17408
R53 R55-R64 R73 R74 R80 R85 R87 = RES_10k_0805: as R50 on sheet LED-Meter; Tolerance: 1%; JLC: C17414
R54 R84 = RES_10k_0805: as R30 on sheet Filter_R; Tolerance: 1%; JLC: C17414
R65 R66 R75 R82 R93 = 0805 0R (0R0) 1%: as R11 on sheet Filter_R; Tolerance: 1%; JLC: C17477
R67 R68 R70 R71 = RES_200R_0805: as R13 on sheet Filter_R; Tolerance: 1%; JLC: C17540
R69 R72 = RES_4k99_0805: as R15 on sheet Filter_R; Tolerance: 1%; JLC: C17677
R78 R86 = RES_4k7_0805: as R51 on sheet LED-Meter; Tolerance: 1%; JLC: C17673
R79 = RES_220k_0805: as R26 on sheet Filter_R; Tolerance: 1%; JLC: C17556
R83 = RES_1k_0805: as R89 on sheet LED-Meter; Tolerance: 1%; JLC: C17513
R94 = RES_47k_0805: as R27 on sheet Filter_R; Tolerance: 1%; JLC: C17713
TR3 = TRIM_2k_lin: as TR1 on sheet Filter_R
TR4 TR6 = TRIM_10k_lin_25: as TR2 on sheet Filter_R
X6-X9 = CON_SOCKET_2x3_Poti: as X10 on sheet LED-Meter

## Sheet Connector.SchDoc: Connectors
size A4; SheetNumber: 4; SheetTotal: 5
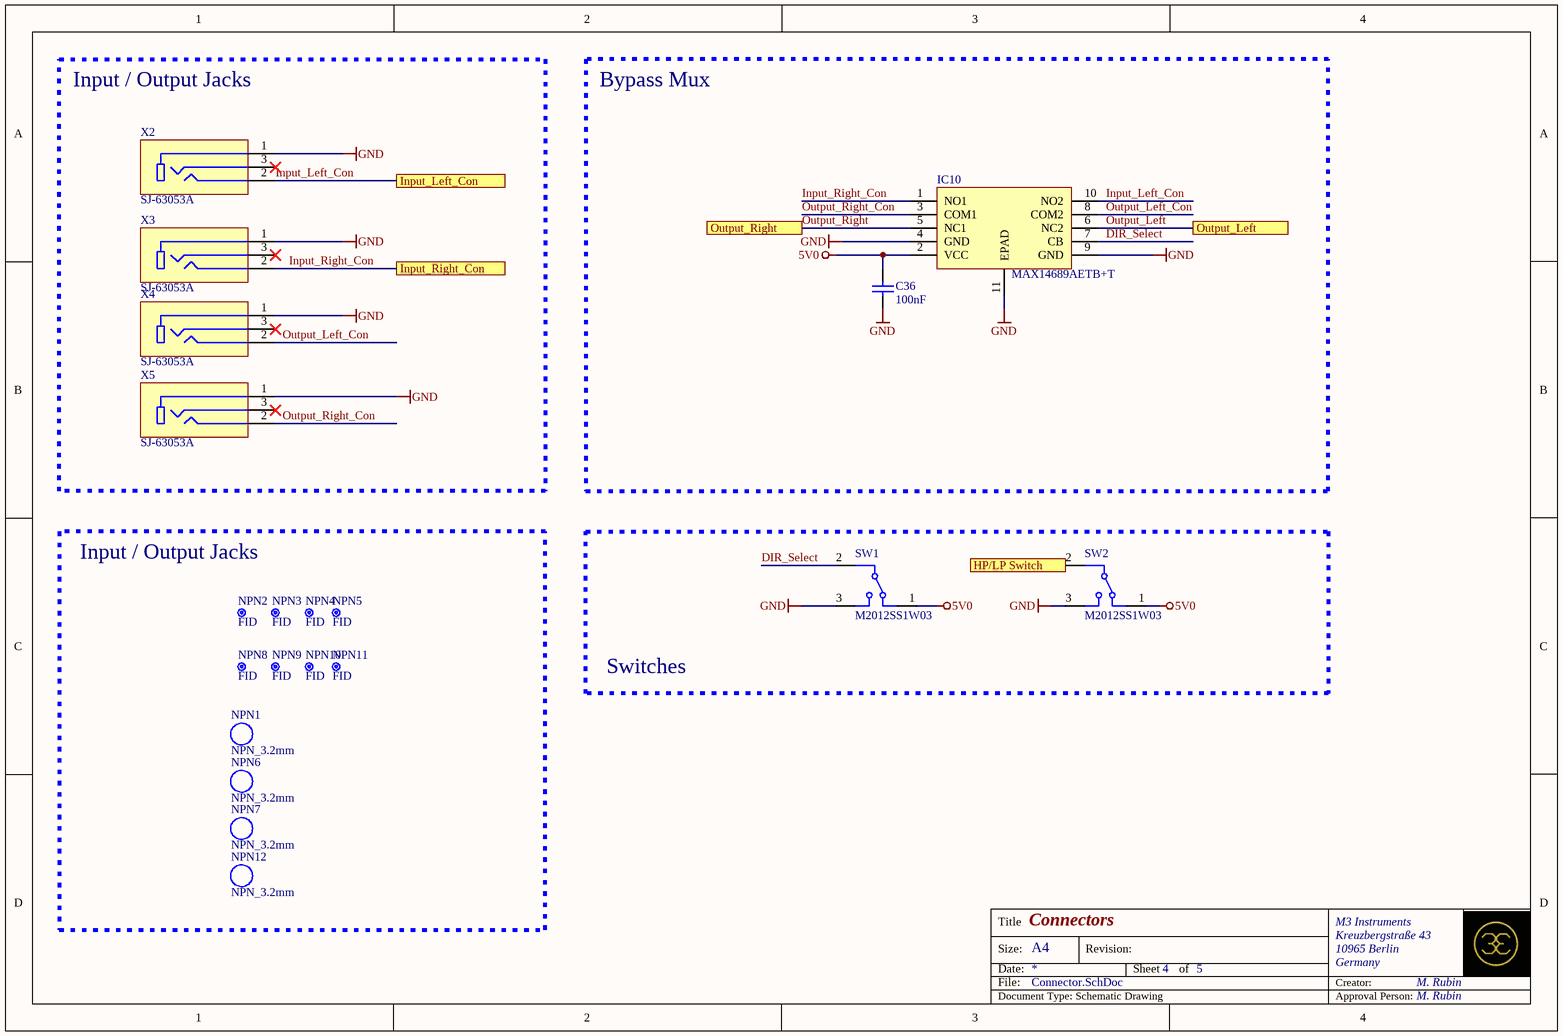
[diagram p4: Connector.SchDoc]

### Parts
C36  100nF  [CAPC1608X95N]
IC10  MAX14689AETB+T  [QFN40P200X250X80_HS-11N]
NPN1  NPN_3.2mm  [HOLE_NPH_3.2_M3]
NPN2  FID  [Fiducial_1mm]
NPN3  FID  [Fiducial_1mm]
NPN4  FID  [Fiducial_1mm]
NPN5  FID  [Fiducial_1mm]
NPN6  NPN_3.2mm  [HOLE_NPH_3.2_M3]
NPN7  NPN_3.2mm  [HOLE_NPH_3.2_M3]
NPN8  FID  [Fiducial_1mm]
NPN9  FID  [Fiducial_1mm]
NPN10  FID  [Fiducial_1mm]
NPN11  FID  [Fiducial_1mm]
NPN12  NPN_3.2mm  [HOLE_NPH_3.2_M3]
SW1  M2012SS1W03  [M2012SS1W03]
SW2  M2012SS1W03  [M2012SS1W03]
X2  SJ-63053A  [CUI_SJ-63053A]
X3  SJ-63053A  [CUI_SJ-63053A]
X4  SJ-63053A  [CUI_SJ-63053A]
X5  SJ-63053A  [CUI_SJ-63053A]

### Blocks framed on the sheet
Input / Output Jacks: X2-X5
Bypass Mux: C36 IC10
Input / Output Jacks: NPN1-NPN12
Switches: SW1 SW2

### Ports
HP/LP Switch, Input_Left_Con, Input_Right_Con, Output_Left, Output_Right

### Nets
5V0: C36.1 IC10.2(VCC) SW1.1 SW2.1
GND: C36.2 IC10.4(GND) IC10.9(GND) IC10.11(EPAD) SW1.3 SW2.3 X2.1 X3.1 X4.1 X5.1
DIR_Select: IC10.7(CB) SW1.2
Input_Left_Con: IC10.10(NO2) X2.2 ; port Input_Left_Con
Input_Right_Con: IC10.1(NO1) X3.2 ; port Input_Right_Con
Output_Left: IC10.6(NC2) ; port Output_Left
Output_Left_Con: IC10.8(COM2) X4.2
Output_Right: IC10.5(NC1) ; port Output_Right
Output_Right_Con: IC10.3(COM1) X5.2
NetIC4_7: SW2.2 ; port HP/LP Switch

Not connected (* = marked no-connect by the designer): X2 3*; X3 3*; X4 3*; X5 3*

### Notes on the sheet
- Title
- Size:
- Date:
- File:
- A4
- Revision:
- Sheet
- of
- Creator:
- Document Type: Schematic Drawing
- Approval Person:

### Library data of the parts
C36 = CAP_100nF_0603: as C24 on sheet Power; JLC: C14663
IC10 = IC_MAX14689AETB+T: as IC4 on sheet Filter_R; Manufacturer Part Number: MAX14689AETB+T
NPN1 NPN6 NPN7 NPN12 = NPH_3.2mm_M3
NPN2-NPN5 NPN8-NPN11 = Fiducial_1mm
SW1 SW2 = SW_M2012SS1W03: Kippschalter SPDT Panelmontage; Manufacturer: NKK Switches; Alternatives allowed: NO; Manufacturer Part Number: M2012SS1W03
X2-X5 = Phone_Jack_1/4_SJ-63053A: Telefon-Steckverbinder 6.35 mm, Stereo, Right Angle, Through Hole Mount, 3 Conductors, 0 Internal Switches, Audio Jack Connector; Manufacturer: CUI Devices; Alternatives allowed: NO; Manufacturer Part Number: SJ-63053A

## Nets that join several sheets
5V0: Power (R49.2), Filter_R (C12.2 IC4.2), Filter_L (C54.2 IC14.2), Connector (C36.1 IC10.2 SW1.1 SW2.1)
9V3: Power (L1.2 R42.2 R48.1), LED-Meter (6 pins), Filter_R (6 pins), Filter_L (6 pins)
-9V3: Power (D7.K L2.2), LED-Meter (6 pins), Filter_R (6 pins), Filter_L (6 pins)
GND: Power (13 pins), LED-Meter (9 pins), Filter_R (30 pins), Filter_L (30 pins), Connector (10 pins)
Filter_Input_Left: LED-Meter (R101.1), Filter_L (IC3.1 R57.1 R74.1)
Filter_Input_Right: LED-Meter (R102.1), Filter_R (IC1.1 R3.1 R20.1)
Input_Left_Con: Filter_L (R75.1), Connector (IC10.10 X2.2)
Input_Right_Con: Filter_R (R21.1), Connector (IC10.1 X3.2)
NetIC4_7: Filter_R (IC4.7), Filter_L (IC14.7), Connector (SW2.2)
Output_Left: Filter_L (C50.2 C51.2 R87.2), Connector (IC10.6)
Output_Right: Filter_R (C10.2 C11.2 R33.2), Connector (IC10.5)